# Altium schematic sheet L298N_One_Layer.SchDoc
size A; SheetNumber: 1; SheetTotal: 1
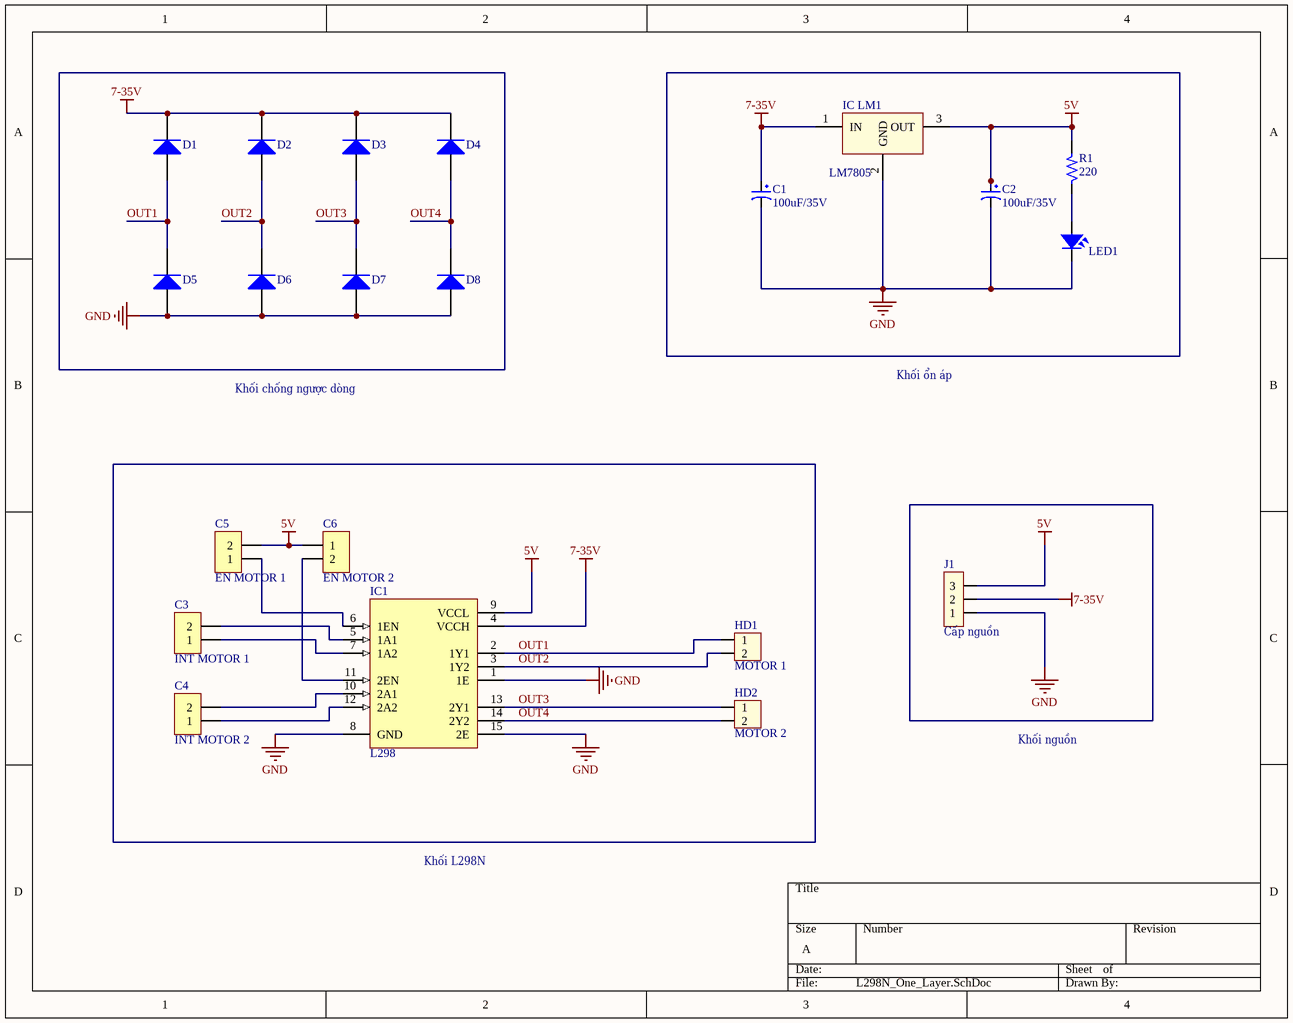
[diagram p0: L298N_One_Layer.SchDoc]

## Parts
C1  100uF/35V  [CP1.5/3.4]
C2  100uF/35V  [CP1.5/3.4]
C3  INT MOTOR 1  [J2-C1T]
C4  INT MOTOR 2  [J2-C1T]
C5  EN MOTOR 1  [J2-C1T]
C6  EN MOTOR 2  [J2-C1T]
D1  Diode  [D5AN]  (value not drawn)
D2  Diode  [D5AN]  (value not drawn)
D3  Diode  [D5AN]  (value not drawn)
D4  Diode  [D5AN]  (value not drawn)
D5  Diode  [D5AN]  (value not drawn)
D6  Diode  [D5AN]  (value not drawn)
D7  Diode  [D5AN]  (value not drawn)
D8  Diode  [D5AN]  (value not drawn)
HD1  MOTOR 1  [HED2]
HD2  MOTOR 2  [HED2]
IC1  L298  [DIP15SL2]
IC_LM1  LM7805  [QTO-220H3]
J1  Cấp nguồn  [JP3]
LED1  LED  [LED-3MM-YELLOW]  (value not drawn)
R1  220  [R1/4W]

## Nets
5V: C2.1 C5.2 C6.1 IC1.9(VCCL) IC_LM1.3(OUT) J1.3 R1.2
7-35V: C1.1 D1.2(K) D2.2(K) D3.2(K) D4.2(K) IC1.4(VCCH) IC_LM1.1(IN) J1.2
GND: C1.2 C2.2 D5.1(A) D6.1(A) D7.1(A) D8.1(A) IC1.1(1E) IC1.8(GND) IC1.15(2E) IC_LM1.2(GND) J1.1 LED1.2
OUT1: D1.1(A) D5.2(K) HD1.1 IC1.2(1Y1)
OUT2: D2.1(A) D6.2(K) HD1.2 IC1.3(1Y2)
OUT3: D3.1(A) D7.2(K) HD2.1 IC1.13(2Y1)
OUT4: D4.1(A) D8.2(K) HD2.2 IC1.14(2Y2)
NetC3_1: C3.1 IC1.7(1A2)
NetC3_2: C3.2 IC1.5(1A1)
NetC4_1: C4.1 IC1.12(2A2)
NetC4_2: C4.2 IC1.10(2A1)
NetC5_1: C5.1 IC1.6(1EN)
NetC6_2: C6.2 IC1.11(2EN)
NetLED1_1: LED1.1 R1.1

## Notes on the sheet
- Khối chống ngược dòng
- Khối ổn áp
- Khối nguồn
- Khối L298N

## Library data of the parts
C1 C2 = CP3: Cap 100uF/35V - 470uF/16V; Value: 100uF/35V/50V; Description 1: 1000uF/6,3V - 470uF/16V - 330uF - 25V; Description 2: 220uF/35V - 100uF/50V - 63V - 4,7uF/200V; Description 3: 22uF => 33uF100V - 3,3uF => 4,7uF/250V; Description 4: 2,2uF =>3,3uF/350 - 2,2uF/400V - 1uF/450V
C3-C6 = JP2x1-2.0: WR-PHD 2.00 mm Socket Header; Manufacturer: W¨¹rth Elektronik eiSos GmbH; partNo: 62000211821; ComponentLink1 Description: Manufacturer; ComponentLink2 Description: Datasheet; NoPins: 02; Created Date: 2 April 2013; ComponentLink1URL: http://www.we-online.com; ComponentLink2URL: http://katalog.we-online.de/em/datasheet/6200xx11821.pdf; Created by: Karrer Zheng
D1-D8 = Diode: Default Diode; Code - JEDEC: DO-214-AB; Value: 1N5007; Published: 8-Jun-2000; Revision: July-2002: Re-released for DXP Platform.; Publisher: Altium Limited
HD1 HD2 = Hed2: Header 2 (Green); Value: Header 2
IC1 = L298: Dual Full-H Driver; Note: The tab is elec is connected to GND pin; Published: 15-May-2002; DatasheetVersion: Jun-1990; PackageReference: KV015; Publisher: Altium Limited; PackageDescription: TO, Thru-Hole, Vertical, Heatsink Mounted; 15 Bent Staggered Leads; Pitch 1.27 mm; ComponentLink1Description: Manufacturer Link; ComponentLink1URL: http://www.ti.com/
IC_LM1 = LM78xx: On ap +, from + 5 to + 24VDC; Value: LM7805
J1 = JP3: Jumper 3; Value: J3
LED1 = LED: LED Single colour Green and Red; Value: LED 3 ly Single Colour
R1 = Res_1: Resistor 1/4W; Value: R1/4W - 1K